# EAGLE design RNG_FinalBoard (EAGLE 7.3.0)

## Sheet 1 of 2
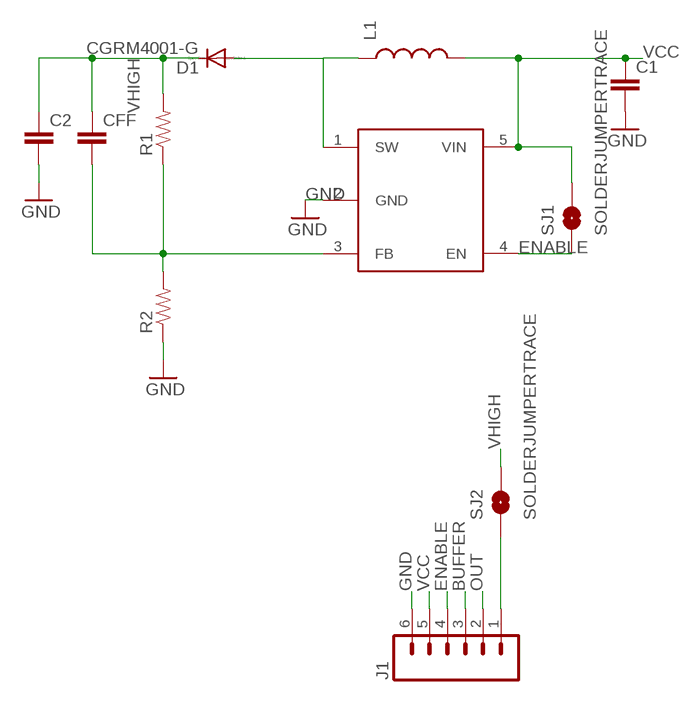
[diagram p0: schematic, sheet 1]

### Parts
C1  CAP0603-CAP  [0603-CAP]
C2  CAP0603-CAP  [0603-CAP]
CFF  CAP0603-CAP  [0603-CAP]
D1  CGRM4001-G  [SOD-123_MINI-SMA]
J1  M06SILK_FEMALE_PTH  [1X06]
L1  INDUCTOR0805  [0805]
R1  0.27OHM-1/10W-1%(0603)  [0603-RES]
R2  0.27OHM-1/10W-1%(0603)  [0603-RES]
SJ1  SOLDERJUMPERTRACE  [SJ_2S-TRACE]
SJ2  SOLDERJUMPERTRACE  [SJ_2S-TRACE]
U$1  TPS61040  [SOT23-5]

### Nets
BUFFER: J1.3 ; also sheet 2
ENABLE: J1.4 SJ1.1 U$1.4(EN)
GND: C1.2 J1.6 R2.1 U$1.2(GND) ; also sheet 2
N$1: CFF.2 R1.1 R2.2 U$1.3(FB)
N$2: D1.A L1.1 U$1.1(SW)
N$10: J1.1 SJ2.1
OUT: J1.2 ; also sheet 2
VCC: C1.1 J1.5 L1.2 SJ1.2 U$1.5(VIN) ; also sheet 2
VHIGH: C2.1 CFF.1 D1.C R1.2 SJ2.2 ; also sheet 2
Unconnected: C2.2

## Sheet 2 of 2
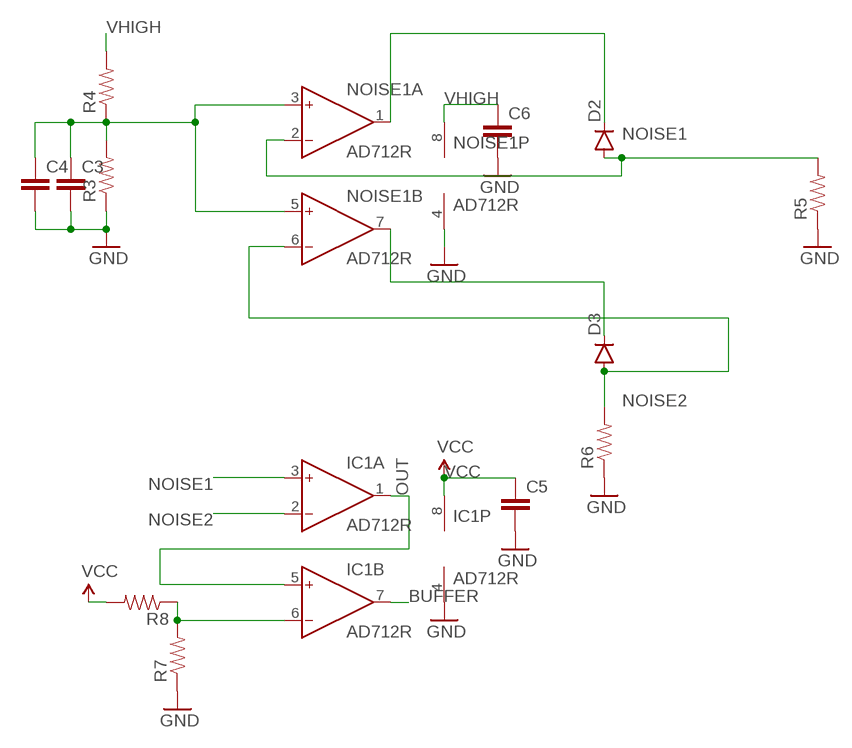
[diagram p1: schematic, sheet 2]

### Parts
C3  CAP0603-CAP  [0603-CAP]
C4  CAP0603-CAP  [0603-CAP]
C5  CAP0603-CAP  [0603-CAP]
C6  CAP0603-CAP  [0603-CAP]
D2  DIODESOD523  [SOD523]
D3  DIODESOD523  [SOD523]
IC1  AD712R  [SO8]
NOISE1  AD712R  [SO8]
R3  RESISTOR0603  [0603-RES]
R4  RESISTOR0603  [0603-RES]
R5  RESISTOR0603  [0603-RES]
R6  RESISTOR0603  [0603-RES]
R7  RESISTOR0603-RES  [0603-RES]
R8  RESISTOR0603-RES  [0603-RES]

### Nets
BUFFER: IC1.7(B:OUT) ; also sheet 1
GND: C3.2 C4.2 C5.2 C6.2 IC1.4(P:V-) NOISE1.4(P:V-) R3.1 R5.1 R6.1 R7.1 ; also sheet 1
N$4: D2.C NOISE1.1(A:OUT)
N$5: D3.C NOISE1.7(B:OUT)
N$6: IC1.6(B:IN-) R7.2 R8.1
N$9: C3.1 C4.1 NOISE1.3(A:IN+) NOISE1.5(B:IN+) R3.2 R4.1
NOISE1: D2.A IC1.3(A:IN+) NOISE1.2(A:IN-) R5.2
NOISE2: D3.A IC1.2(A:IN-) NOISE1.6(B:IN-) R6.2
OUT: IC1.1(A:OUT) IC1.5(B:IN+) ; also sheet 1
VCC: C5.1 IC1.8(P:V+) R8.2 ; also sheet 1
VHIGH: C6.1 NOISE1.8(P:V+) R4.2 ; also sheet 1

## Library data of the parts
C1 C2 C5 C6 CFF = SparkFun-Capacitors:CAP: Capacitor Standard 0603 ceramic capacitor, and 0.1" leaded capacitor.
C3 C4 = SparkFun-Passives:CAP: Capacitor Standard 0603 ceramic capacitor, and 0.1" leaded capacitor.
D1 = diode:CGRM400*-G: Molded plasitc,JEDEC SOD-123/Mini SMA Source: Comchip CGRM4001-G.pdf
D2 D3 = SparkFun-DiscreteSemi:DIODE: Diode These are standard reverse protection diodes and small signal diodes. SMA package can handle up to about 1A. SOD-323 can handle about 200mA. What the SOD-323 package when ordering, there are some mfgs out there that are 5-pin packages.
IC1 NOISE1 = analog-devices:AD712: Dual Precision, Low Cost, High Speed BiFET Op Amp Source: http://www.analog.com/static/imported-files/data_sheets/AD712.pdf; MF: ALTERA CORPORATION; MPN: AD712KRZ; OC_FARNELL: 1263975; OC_NEWARK: 59K4556
J1 = SparkFun-Connectors:M06: Header 6 Standard 6-pin 0.1" header. Use with straight break away headers (SKU : PRT-00116), right angle break away headers (PRT-00553), swiss pins (PRT-00743), machine pins (PRT-00117), and female headers (PRT-00115). Molex polarized connector foot print use with SKU : PRT-08094 with associated crimp pins and housings. NOTES ON THE VARIANTS LOCK and LOCK_LONGPADS... This footprint was designed to help hold the alignment of a through-hole component (i.e. 6-pin header) while soldering it into place. You may notice that each hole has been shifted either up or down by 0.005 of an inch from it's more standard position (which is a perfectly straight line). This slight alteration caused the pins (the squares in the middle) to touch the edges of the holes. Because they are alternating, it causes a "brace" to hold the component in place. 0.005 has proven to be the perfect amount of "off-center" position when using our standard breakaway headers. Although looks a little odd when you look at the bare footprint, once you have a header in there, the alteration is very hard to notice. Also,if you push a header all the way into place, it is covered up entirely on the bottom side. This idea of altering the position of holes to aid alignment will be further integrated into the Sparkfun Library for other footprints. It can help hold any component with 3 or more connection pins.; PROD_ID: CONN-08437
L1 = SparkFun-Passives:INDUCTOR: Inductors Basic Inductor/Choke - 0603 and 1206. Footprints are not proven and vary greatly between part numbers. INDUCTOR POWER 3.3UH 4.0A SMD 0.197" L x 0.197" W x 0.177" H (5.00mm x 5.00mm x 4.50mm)
R1 R2 = SparkFun-Resistors:0.27OHM-1/10W-1%(0603): RES-08787; PROD_ID: RES-08787
R3-R6 = SparkFun-Resistors:RESISTOR: Resistor Basic schematic elements and footprints for 0603, 1206, and PTH resistors.
R7 R8 = SparkFun-Passives:RESISTOR: Resistor Basic schematic elements and footprints for 0603, 1206, and PTH resistors.
SJ1 SJ2 = SparkFun-Retired:SOLDERJUMPER: Solder Jumper Standard SMD solder jumper. Used to automate production. Two varients : Normally Open and Normally Closed are the same, but have different paste layers. NC will have a large amount of paste and should jumper during reflow.
U$1 = SparkFun-PowerIC:TPS61040: TPS61041 DC DC Custom

## Board
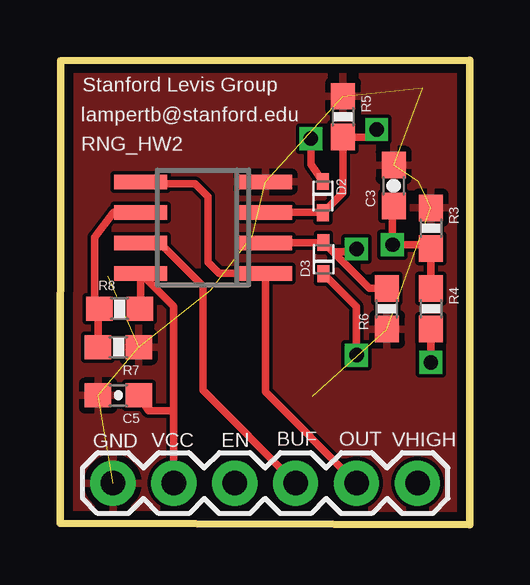
[diagram p2: board, top side]
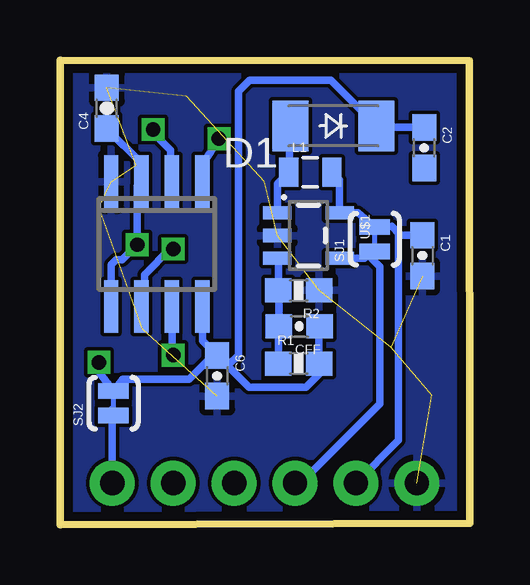
[diagram p3: board, bottom side, seen from below]

Size 17.09 x 19.35 mm. Coordinates in mm from the lower left corner, seen from the top.
Outline: 0,0.05 0.03,19.33 17.09,19.35 17.09,0 0,0.05
Copper layers (1*16): Top 0.0356mm / dielectric 1.5011mm / Bottom 0.0356mm
Design rules "LaenPCBOrder": minimum track width 6mil, minimum drill 13mil, track to track 6mil, track to pad 6mil, pad to pad 6mil, via to via 6mil, smd to smd 6mil, copper to edge 15mil, drill to drill 6mil, minimum pad ring 7mil, minimum via ring 7mil, stop-mask expansion 3mil, vias tented up to drill 0mil, thermal gap 10mil

### Footprints (pad centres in the part's own frame; a part is rotated, then mirrored left to right if it is on the bottom)
0603-CAP = smd 1.1 x 1: 1 -0.85,0; 2 0.85,0
SOD-123_MINI-SMA = smd 1.5 x 2.1: A 1.8,0; C -1.8,0
SOD523 = smd 0.7 x 0.5: A 0.7,0; C -0.6,0
SO8 = smd 0.6 x 2.2: 1 -1.905,-2.6; 2 -0.635,-2.6; 3 0.635,-2.6; 4 1.905,-2.6; 5 1.905,2.6; 6 0.635,2.6; 7 -0.635,2.6; 8 -1.905,2.6
1X06 = drill 1.016 pad 1.88: 1 0,0; 2 2.54,0; 3 5.08,0; 4 7.62,0; 5 10.16,0; 6 12.7,0
0805 = smd 0.8 x 1.2: 1 -0.9,0; 2 0.9,0
0603-RES = smd 1.1 x 1: 1 -0.85,0; 2 0.85,0
SJ_2S-TRACE = smd 0.635 x 1.27: 1 -0.508,0; 2 0.508,0
SOT23-5 = smd 0.55 x 1.2: 1 -0.95,-1.3; 2 0,-1.3; 3 0.95,-1.3; 4 0.95,1.3; 5 -0.95,1.3

### Placement (x,y rotation side)
C1  1.98,11.2 270 bottom
C2  1.91,15.7 270 bottom
C3  13.92,14.12 90 top
C4  15.14,17.35 90 bottom
C5  2.44,5.38 180 top
C6  10.54,6.2 270 bottom
CFF  7.11,8.25 180 bottom
D1  5.69,16.61 180 bottom
D2  10.97,13.69 270 top
D3  11,11.05 90 top
IC1  5.97,12.37 90 top
J1  14.91,1.73 180 top
L1  6.65,14.68 0 bottom
NOISE1  13.06,11.68 180 bottom
R1  7.14,6.71 0 bottom
R2  7.14,9.75 180 bottom
R3  15.47,12.34 270 top
R4  15.47,8.99 270 top
R5  11.81,16.99 270 top
R6  13.64,8.99 90 top
R7  2.44,7.39 180 top
R8  2.49,8.99 0 top
SJ1  3.96,11.89 90 bottom
SJ2  14.86,5.05 90 bottom
U$1  6.73,12.04 270 bottom

### Tracks (layer width: path | path; a pad name or v marks a point on that pad's centre or on a via)
BUFFER
  Top 0.305: J1.3 5.97,5.59 5.97,9.93 4.17,11.73 IC1.7
ENABLE
  Bottom 0.305: U$1.4 4.4,11.09 SJ1.1 4.09,11.07 3.76,10.74 3.76,5.03 7.06,1.73 J1.4
GND  (13 unrouted)
  pour Top: -2.03,24.51 -3.25,24.51 -3.25,-2.34 20.14,-2.34 20.14,23.95 -1.98,23.95 -1.98,24.51
  pour Bottom: -1.73,24.46 -2.95,24.46 -2.95,-2.39 20.45,-2.39 20.45,23.9 -1.68,23.9 -1.68,24.46
N$1
  Bottom 0.305: U$1.3 8.17,11.23 8.23,11.23 7.99,10.98 R2.2 7.96,9.73 CFF.2 7.99,8.23 R1.1
N$2
  Bottom 0.305: U$1.1 8.03,14.21 L1.1 7.59,14.72 7.59,14.83 7.54,14.88 D1.A
N$4  (via drill 0.6)
  Top 0.305: D2.C 10.47,15 v10.47,16.08
  Bottom 0.305: v10.47,16.08 11.15,15.01 NOISE1.1
N$5  (via drill 0.6)
  Top 0.305: D3.C 12.37,9.08 v12.37,7.06
  Bottom 0.305: v12.37,7.06 12.42,7.11 NOISE1.7
N$6
  Top 0.305: R7.2 1.59,8.89 R8.1 1.45,9.01 1.45,11.96 2.24,13 IC1.6
N$9  (via drill 0.6)
  Top 0.305: R4.1 R3.2 15.3,11.66 v13.87,11.66 13.87,13.22 C3.1
  Bottom 0.305: NOISE1.5 14.96,10.82 14.76,11.02 14.5,11.02 v13.87,11.66 13.87,14.11 NOISE1.3 13.69,15.05 C4.1
N$10
  Bottom 0.305: SJ2.1 14.91,4.8 J1.1
NOISE1  (via drill 0.6)
  Top 0.305: 8.61,12.98 8.59,12.98 IC1.3 10.96,13 D2.A 11.81,13.83 R5.2 12.89,16.14 v13.21,16.46
  Bottom 0.305: NOISE1.2 12.47,14.33 12.47,15.6 13.21,16.33 v13.21,16.46
NOISE2  (via drill 0.6)
  Top 0.305: IC1.2 11.04,11.73 D3.A 11.39,11.36 | 11.39,11.36 12.91,9.84 R6.2 | v12.37,11.48 12.25,11.36 11.39,11.36
  Bottom 0.305: NOISE1.6 13.56,9.21 13.56,10.41 12.5,11.48 v12.37,11.48
OUT
  Top 0.305: IC1.5 3.45,14.2 5.64,14.2 6.17,13.67 6.17,10.92 6.63,10.46 IC1.1 8.57,5.53 J1.2
VCC
  Top 0.305: R8.2 3.37,9.02 IC1.8 4.75,9.08 4.75,4.75 | 4.75,4.75 J1.5 | C5.1 3.7,4.75 4.75,4.75
  Bottom 0.305: L1.2 5.43,14.36 U$1.5 4.66,12.99 SJ1.2 3.25,12.42 2.97,12.14 | J1.5 2.97,3.51 2.97,12.14 | 2.97,12.14 2.88,12.05 C1.1
VHIGH  (via drill 0.6)
  Top 0.305: v15.47,6.76 R4.2
  Bottom 0.305: C2.1 3.83,16.55 D1.C 5.79,18.52 9.2,18.52 9.65,18.06 9.65,7.06 10.04,6.67 10.17,6.67 | v15.47,6.76 15.47,6.35 SJ2.2 14.48,6.05 11.71,6.05 10.71,7.05 C6.1 | C6.1 11.15,7.66 NOISE1.8 | C6.1 10.17,6.67 | 10.17,6.67 9.21,5.72 6.83,5.72 6.29,6.26 R1.2 6.29,8.23 CFF.1 6.25,8.27 6.25,8.31

### Text on the board
tNames: Stanford Levis Group | lampertb@stanford.edu | RNG_HW2 | GND | VCC | EN | BUF | OUT | VHIGH